# EAGLE design Maduino Zero Canbus RS485 v2.0 (EAGLE 6.1)
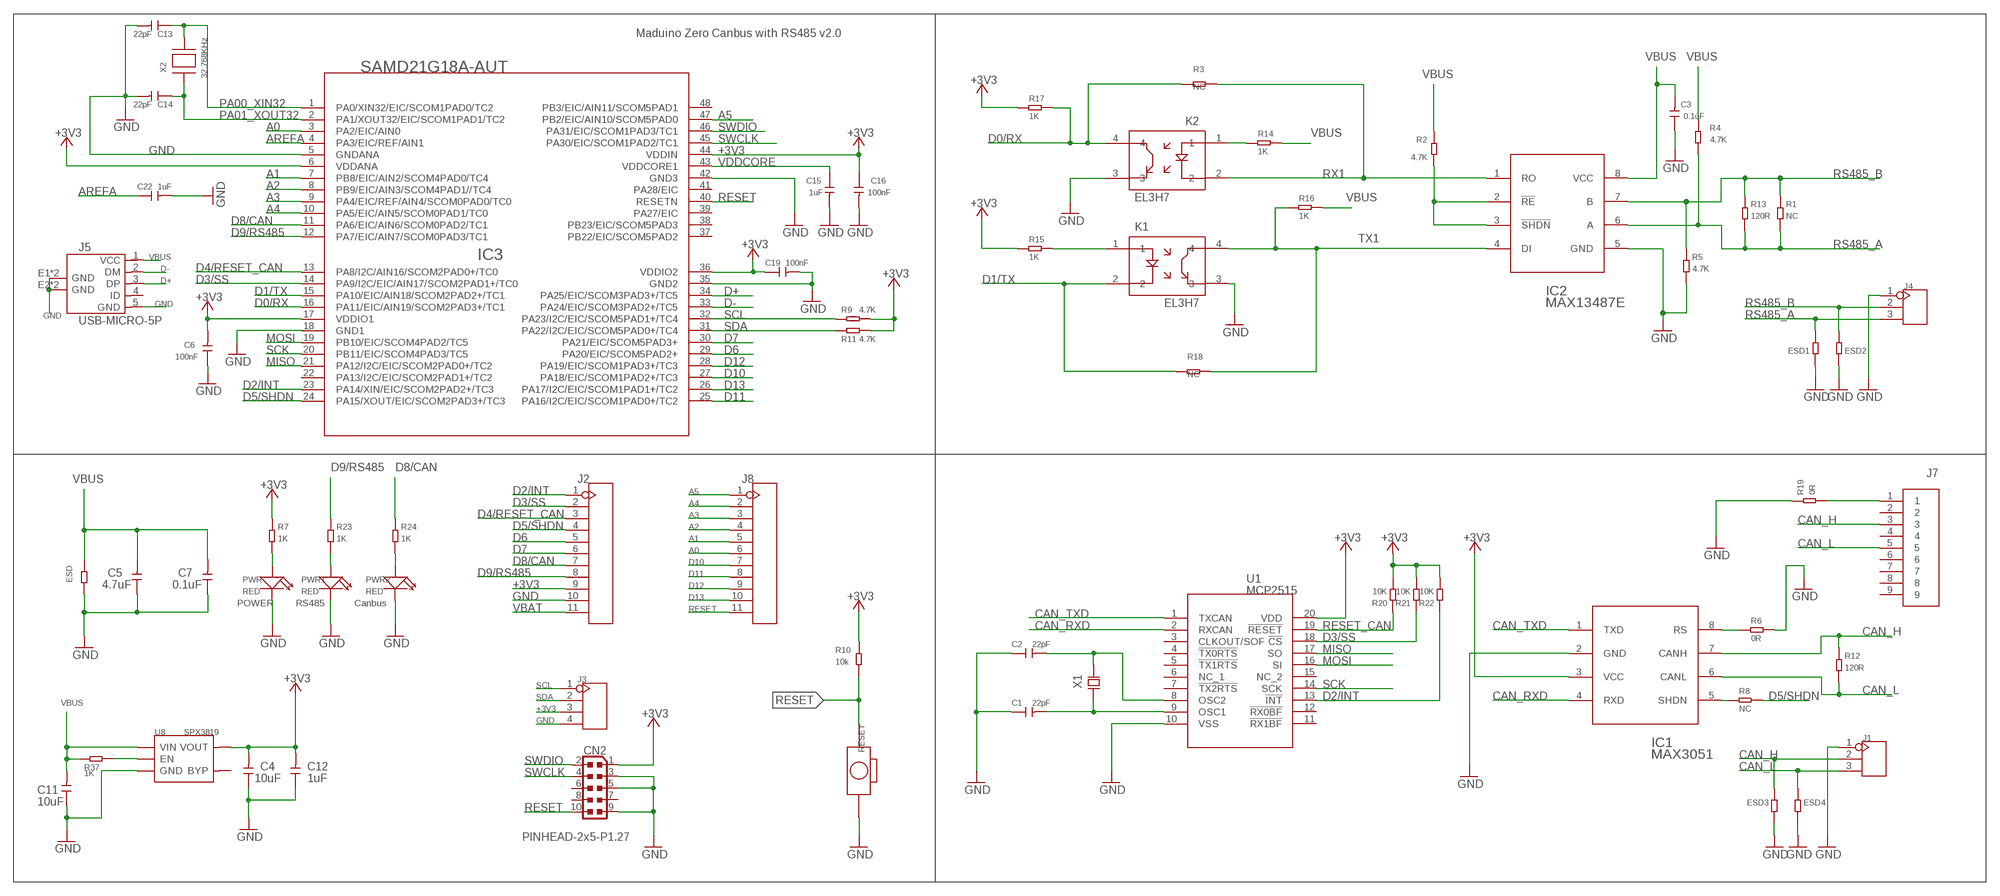
[diagram p0: schematic, sheet 1]

## Parts
C1  22pF  C-0603  [0603]
C2  22pF  C-0603  [0603]
C3  0.1uF  C-0603  [0603]
C4  10uF  C-0603  [0603]
C5  4.7uF  C-0603  [0603]
C6  100nF  C-0603  [0603]
C7  0.1uF  C-0603  [0603]
C11  10uF  C-0603  [0603]
C12  1uF  C-0603  [0603]
C13  22pF  C-0603  [0603]
C14  22pF  C-0603  [0603]
C15  1uF  C-0603  [0603]
C16  100nF  C-0603  [0603]
C19  100nF  C-0603  [0603]
C22  1uF  C-0603  [0603]
CN2  PINHEAD-2x5-P1.27  0171_PH127-205DF055G00AROUND-PADS  [PINHEAD_2X05_127]
ESD  R-0603  [R0603]
ESD1  R-0603  [R0603]
ESD2  R-0603  [R0603]
ESD3  NC  R-0603  [R0603]
ESD4  NC  R-0603  [R0603]
IC1  MAX3051  [DIP8_MX3051]
IC2  MAX13487E  [DIP8_MAX13487]
IC3  SAMD21G18A-AUT  ATSAMD21G18A-AUT  [TQFP48-7X7]
J1  HEADER-3P-2.54  [3P-2.54]
J2  HEADER-11P-2.54  [11P-2.54]
J3  HEADER-4P-60/35MILROUND  [4P-65/35ROUND]
J4  HEADER-3P-2.54  [3P-2.54]
J5  USB-MICRO-5P  [MICRO-USB-5P]
J7  DB9-90  [DIP9-DB9-P2.77]
J8  HEADER-11P-2.54  [11P-2.54]
K1  EL3H7  [SOP-4_P1.27]
K2  EL3H7  [SOP-4_P1.27]
PWR  RED  LED'0603'  [LED-0603]
PWR1  RED  LED'0603'  [LED-0603]
PWR2  RED  LED'0603'  [LED-0603]
R1  NC  R-0603  [R0603]
R2  4.7K  R-0603  [R0603]
R3  NC  R-0603  [R0603]
R4  4.7K  R-0603  [R0603]
R5  4.7K  R-0603  [R0603]
R6  0R  R-0603  [R0603]
R7  1K  R-0603  [R0603]
R8  NC  R-0603  [R0603]
R9  4.7K  R-0603  [R0603]
R10  10k  R-0603  [R0603]
R11  4.7K  R-0603  [R0603]
R12  120R  R-0603  [R0603]
R13  120R  R-0603  [R0603]
R14  1K  R-0603  [R0603]
R15  1K  R-0603  [R0603]
R16  1K  R-0603  [R0603]
R17  1K  R-0603  [R0603]
R18  NC  R-0603  [R0603]
R19  0R  R-0603  [R0603]
R20  10K  R-0603  [R0603]
R21  10K  R-0603  [R0603]
R22  10K  R-0603  [R0603]
R23  1K  R-0603  [R0603]
R24  1K  R-0603  [R0603]
R37  1K  R-0603  [R0603]
RESET  BOTTON-2P-90D  [2P-7.62X3.56-90D]
U1  MCP2515  [SSOP-20]
U8  SPX3819  [SOT23-5]
X1  XTAL-8MHZ  [SMD-5032_2P_8M]
X2  32.768KHz  XTAL-3.2X1.5  [XTAL3215]

## Nets
+3V3: C4.2 C6.2 C12.2 C16.1 C19.1 CN2.1 IC1.3(VCC) IC3.6(VDDANA) IC3.17(VDDIO1) IC3.36(VDDIO2) IC3.44(VDDIN) J2.9 J3.3 R7.1 R9.2 R10.2 R11.2 R15.2 R17.2 R20.1 R21.1 R22.1 U1.20(VDD) U8.5(VOUT)
A0: IC3.3(PA2/EIC/AIN0) J8.6
A1: IC3.7(PB8/EIC/AIN2/SCOM4PAD0/TC4) J8.5
A2: IC3.8(PB9/EIC/AIN3/SCOM4PAD1//TC4) J8.4
A3: IC3.9(PA4/EIC/REF/AIN4/SCOM0PAD0/TC0) J8.3
A4: IC3.10(PA5/EIC/AIN5/SCOM0PAD1/TC0) J8.2
A5: IC3.47(PB2/EIC/AIN10/SCOM5PAD0) J8.1
AREFA: C22.1 IC3.4(PA3/EIC/REF/AIN1)
CAN_H: ESD3.1 IC1.7(CANH) J1.2 J7.3 R12.1
CAN_L: ESD4.1 IC1.6(CANL) J1.3 J7.5 R12.2
CAN_RXD: IC1.4(RXD) U1.2(RXCAN)
CAN_TXD: IC1.1(TXD) U1.1(TXCAN)
D0/RX: IC3.16(PA11/EIC/AIN19/SCOM2PAD3+/TC1) K2.4 R3.2 R17.1
D1/TX: IC3.15(PA10/EIC/AIN18/SCOM2PAD2+/TC1) K1.2 R18.2
D2/INT: IC3.23(PA14/XIN/EIC/SCOM2PAD2+/TC3) J2.1 R22.2 U1.13(!INT)
D3/SS: IC3.14(PA9/I2C/EIC/AIN17/SCOM2PAD1+/TC0) J2.2 R21.2 U1.18(!CS)
D4/RESET_CAN: IC3.13(PA8/I2C/AIN16/SCOM2PAD0+/TC0) J2.3
D5/SHDN: IC3.24(PA15/XOUT/EIC/SCOM2PAD3+/TC3) J2.4 R8.1
D6: IC3.29(PA20/EIC/SCOM5PAD2+) J2.5
D7: IC3.30(PA21/EIC/SCOM5PAD3+) J2.6
D8/CAN: IC3.11(PA6/EIC/AIN6/SCOM0PAD2/TC1) J2.7 R24.1
D9/RS485: IC3.12(PA7/EIC/AIN7/SCOM0PAD3/TC1) J2.8 R23.1
D10: IC3.27(PA18/EIC/SCOM1PAD2+/TC3) J8.7
D11: IC3.25(PA16/I2C/EIC/SCOM1PAD0+/TC2) J8.8
D12: IC3.28(PA19/EIC/SCOM1PAD3+/TC3) J8.9
D13: IC3.26(PA17/I2C/EIC/SCOM1PAD1+/TC2) J8.10
D+: IC3.34(PA25/EIC/SCOM3PAD3+/TC5) J5.3(DP)
D-: IC3.33(PA24/EIC/SCOM3PAD2+/TC5) J5.2(DM)
GND: C1.1 C2.1 C3.1 C4.1 C5.1 C6.1 C7.1 C11.1 C12.1 C13.2 C14.2 C15.2 C16.2 C19.2 C22.2 CN2.3 CN2.5 CN2.9 ESD1.1 ESD2.1 ESD3.2 ESD4.2 ESD.2 IC1.2(GND) IC2.5(GND) IC3.5(GNDANA) IC3.18(GND1) IC3.35(GND2) IC3.42(GND3) J1.1 J2.10 J3.4 J4.1 J5.5(GND) J5.E1(GND) J5.E2(GND) J5.P1(GND) J5.P2(GND) K1.3 K2.3 PWR1.- PWR2.- PWR.- R5.1 R6.1 R19.2 RESET.P$2 U1.10(VSS) U8.2(GND)
MISO: IC3.21(PA12/I2C/EIC/SCOM2PAD0+/TC2) U1.17(SO)
MOSI: IC3.19(PB10/EIC/SCOM4PAD2/TC5) U1.16(SI)
N$1: K2.1 R14.2
N$3: PWR.+ R7.2
N$4: C2.2 U1.8(OSC2) X1.2
N$5: C1.2 U1.9(OSC1) X1.1
N$6: K1.1 R15.1
N$7: J7.1 R19.1
N$8: PWR1.+ R23.2
N$9: PWR2.+ R24.2
N$18: IC1.8(RS) R6.2
N$21: IC1.5(SHDN) R8.2
N$24: R37.2 U8.3(EN)
N$36: IC2.2(!RE) IC2.3(!SHDN) R2.1
PA00_XIN32: C13.1 IC3.1(PA0/XIN32/EIC/SCOM1PAD0/TC2) X2.P$2
PA01_XOUT32: C14.1 IC3.2(PA1/XOUT32/EIC/SCOM1PAD1/TC2) X2.P$1
RESET: CN2.10 IC3.40(RESETN) J8.11 R10.1 RESET.P$1
RESET_CAN: R20.2 U1.19(!RESET)
RS485_A: ESD1.2 IC2.6(A) J4.3 R1.1 R4.1 R13.1
RS485_B: ESD2.2 IC2.7(B) J4.2 R1.2 R5.2 R13.2
RX1: IC2.1(RO) K2.2 R3.1
SCK: IC3.20(PB11/EIC/SCOM4PAD3/TC5) U1.14(SCK)
SCL: IC3.32(PA23/I2C/EIC/SCOM5PAD1+/TC4) J3.1 R9.1
SDA: IC3.31(PA22/I2C/EIC/SCOM5PAD0+/TC4) J3.2 R11.1
SWCLK: CN2.4 IC3.45(PA30/EIC/SCOM1PAD2/TC1)
SWDIO: CN2.2 IC3.46(PA31/EIC/SCOM1PAD3/TC1)
TX1: IC2.4(DI) K1.4 R16.2 R18.1
VBAT: J2.11
VBUS: C3.2 C5.2 C7.2 C11.2 ESD.1 IC2.8(VCC) J5.1(VCC) R2.2 R4.2 R14.1 R16.1 R37.1 U8.1(VIN)
VDDCORE: C15.1 IC3.43(VDDCORE1)
Unconnected: CN2.6 CN2.7 CN2.8 IC3.22(PA13/I2C/EIC/SCOM2PAD1+/TC2) IC3.37(PB22/EIC/SCOM5PAD2) IC3.38(PB23/EIC/SCOM5PAD3) IC3.39(PA27/EIC) IC3.41(PA28/EIC) IC3.48(PB3/EIC/AIN11/SCOM5PAD1) J5.4(ID) J7.2 J7.4 J7.6 J7.7 J7.8 J7.9 U1.3(CLKOUT/SOF) U1.4(!TX0RTS) U1.5(!TX1RTS) U1.6(NC_1) U1.7(!TX2RTS) U1.11(!RX1BF) U1.12(!RX0BF) U1.15(NC_2) U8.4(BYP)

## Notes on the sheet
- Maduino Zero Canbus with RS485 v2.0
- POWER | RS485 | Canbus

## Library data of the parts
C1-C7 C11-C16 C19 C22 = Discrete:C*: Ceramic Capacitors
CN2 = Connettori:0171_PH127-205DF055G00A: 2x5 PASSO 1,27
ESD ESD1-ESD4 R1-R24 R37 = Discrete:R*
IC1 = 1mytest:MAX3051
IC2 = 1mytest:MAX13487E
IC3 = IC:ATSAMD21G18A-AUT: Atmel D21 32bit ARM Cortex-M0 microcontroller - 48 PIN TQFP 256KB flash memory + 32KB SRAM
J1 J4 = Connector:HEADER-3P
J2 J8 = Connector:HEADER-11P
J3 = Connector:HEADER-4P
J5 = Connector:USB-MICRO-5P
J7 = 1mytest:DB9-90
K1 K2 = 1mytest:EL3H7: Optocoupler
PWR PWR1 PWR2 = Discrete:LED*
RESET = Discrete:BOTTON-2P
U1 = 1mytest:MCP2515
U8 = IC:SPX3819
X1 = 1mytest:XTAL-8MHZ
X2 = adafruit2:XTAL: Low cost SMT crystals, no capacitors included http://www.ladyada.net/library/eagle

## Net classes
0 default: clearance 0.152 mm
2 gnd: width 0.305 mm, drill 0.559 mm, clearance 0.254 mm
3 usbvcc: width 0.508 mm, drill 0.61 mm, clearance 0.254 mm
4 USBpair: width 0.254 mm, drill 0.406 mm, clearance 0.406 mm

## Board
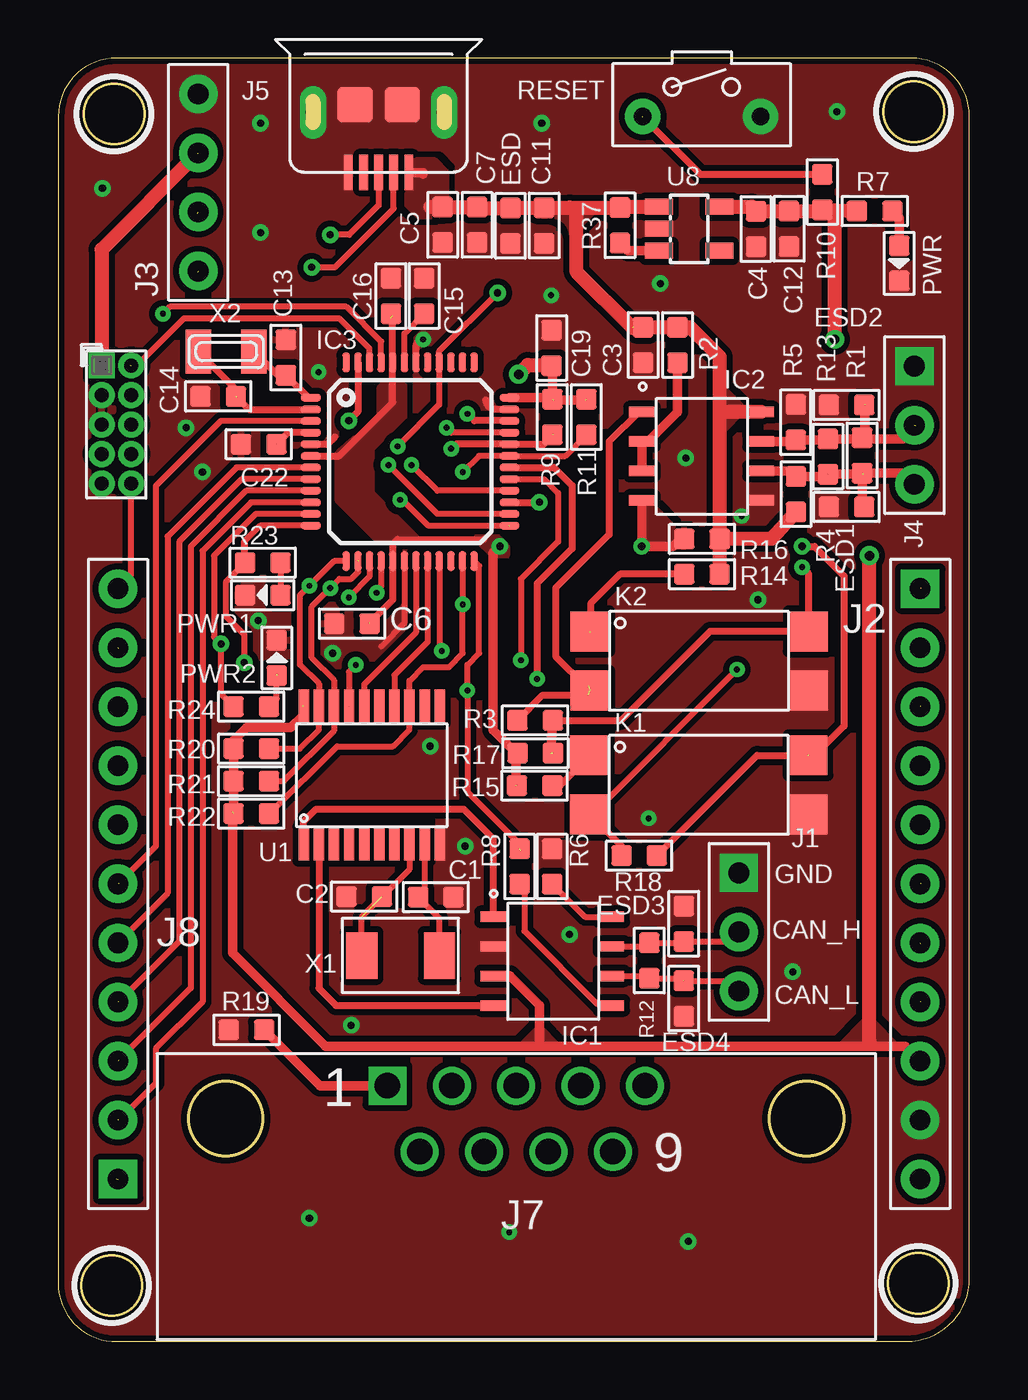
[diagram p1: board, top side]
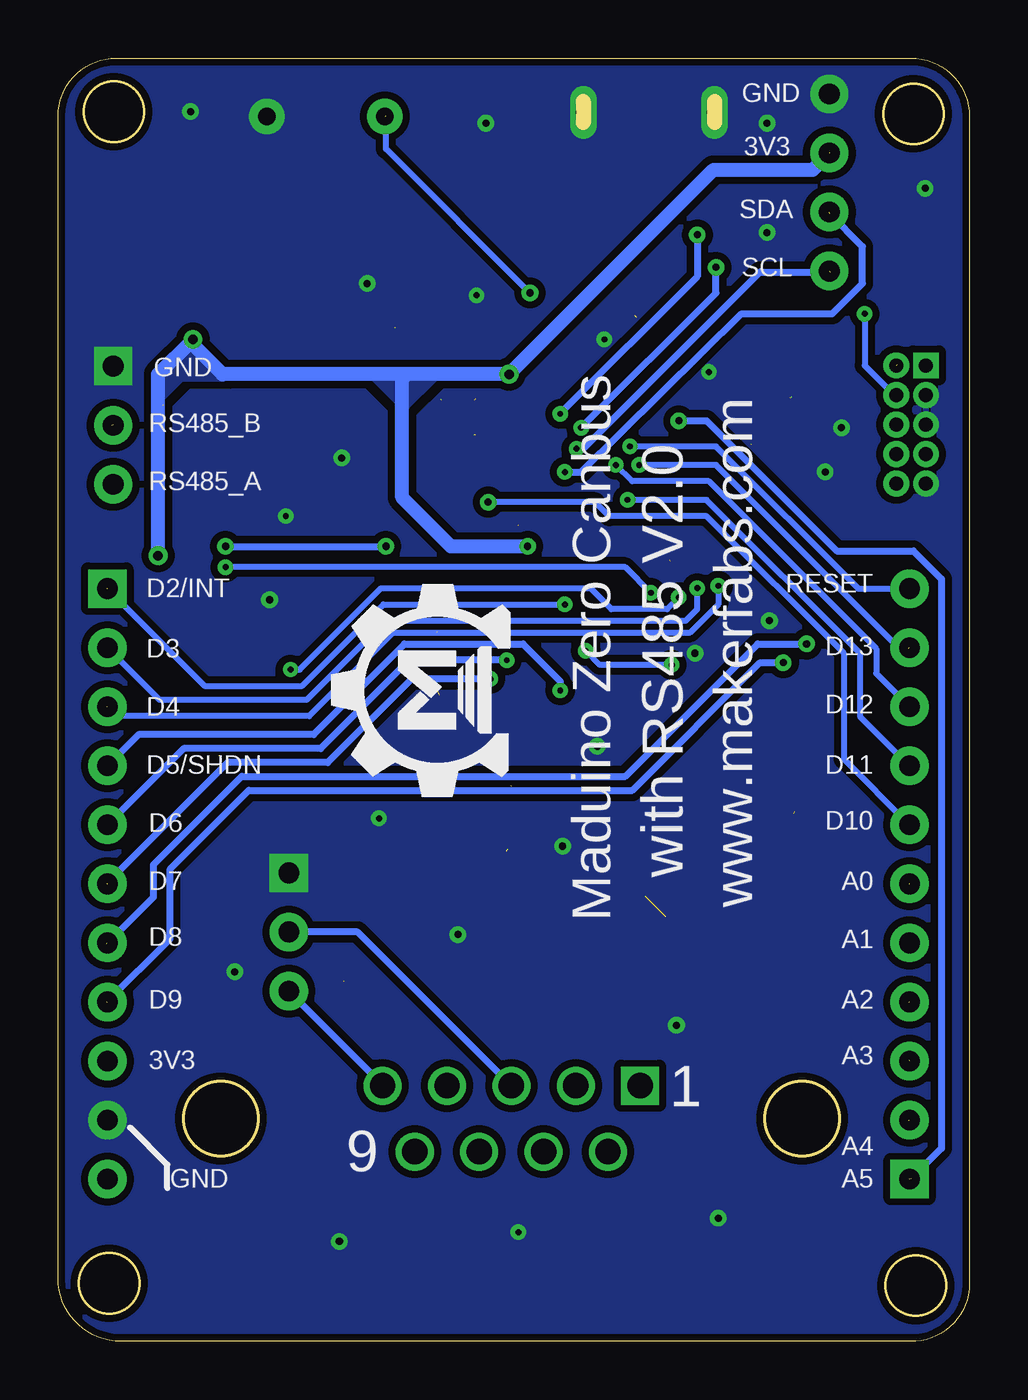
[diagram p2: board, bottom side, seen from below]

Size 39.21 x 55.2 mm. Coordinates in mm from the lower left corner, seen from the top.
Outline: 2.51,55.2 arc90 0.01,52.7 0.01,2.7 arc90 2.31,0 36.51,0 arc90 39.21,2.7 39.21,52.7 arc90 36.71,55.2 2.51,55.2
Outline: circle at 2.41,52.8 radius 1.3
Outline: circle at 2.31,2.4 radius 1.3
Outline: circle at 37.01,2.5 radius 1.3
Outline: circle at 36.81,52.9 radius 1.3
Copper layers (1*16): Top 0.035mm / dielectric 1.5mm / Bottom 0.035mm
Design rules: minimum track width 10mil, minimum drill 10mil, track to track 8mil, track to pad 8mil, pad to pad 8mil, via to via 8mil, smd to smd 8mil, copper to edge 10mil, drill to drill 8mil, minimum pad ring 10mil, minimum via ring 8mil, stop-mask expansion 4mil, vias tented up to drill 100mil, thermal gap 0mil

### Footprints (pad centres in the part's own frame; a part is rotated, then mirrored left to right if it is on the bottom)
0603 = smd 0.889 x 0.889: 1 -0.762,0; 2 0.762,0
PINHEAD_2X05_127 = drill 0.6 pad 1.016 square: 1 -0.635,2.54 | drill 0.6 pad 1.016: 2 0.635,2.54; 3 -0.635,1.27; 4 0.635,1.27; 5 -0.635,0; 6 0.635,0; 7 -0.635,-1.27; 8 0.635,-1.27; 9 -0.635,-2.54; 10 0.635,-2.54
R0603 = smd 0.889 x 0.889: 1 -0.762,0; 2 0.762,0
DIP8_MX3051 = smd 1.1 x 0.45: 1 1.27,3.81; 2 1.27,2.54; 3 1.27,1.27; 4 1.27,0; 5 6.35,0; 6 6.35,1.27; 7 6.35,2.54; 8 6.35,3.81
DIP8_MAX13487 = smd 1.1 x 0.45: 1 1.27,3.81; 2 1.27,2.54; 3 1.27,1.27; 4 1.27,0; 5 6.39,0; 6 6.39,1.27; 7 6.39,2.54; 8 6.39,3.81
TQFP48-7X7 = smd 0.85 x 0.32: 1 -4.275,2.75; 2 -4.275,2.25; 3 -4.275,1.75; 4 -4.275,1.25; 5 -4.275,0.75; 6 -4.275,0.25; 7 -4.275,-0.25; 8 -4.275,-0.75; 9 -4.275,-1.25; 10 -4.275,-1.75; 11 -4.275,-2.25; 12 -4.275,-2.75; 25 4.275,-2.75; 26 4.275,-2.25; 27 4.275,-1.75; 28 4.275,-1.25; 29 4.275,-0.75; 30 4.275,-0.25; 31 4.275,0.25; 32 4.275,0.75; 33 4.275,1.25; 34 4.275,1.75; 35 4.275,2.25; 36 4.275,2.75 | smd 0.32 x 0.85: 13 -2.75,-4.275; 14 -2.25,-4.275; 15 -1.75,-4.275; 16 -1.25,-4.275; 17 -0.75,-4.275; 18 -0.25,-4.275; 19 0.25,-4.275; 20 0.75,-4.275; 21 1.25,-4.275; 22 1.75,-4.275; 23 2.25,-4.275; 24 2.75,-4.275; 37 2.75,4.275; 38 2.25,4.275; 39 1.75,4.275; 40 1.25,4.275; 41 0.75,4.275; 42 0.25,4.275; 43 -0.25,4.275; 44 -0.75,4.275; 45 -1.25,4.275; 46 -1.75,4.275; 47 -2.25,4.275; 48 -2.75,4.275
3P-2.54 = drill 0.889 pad 1.651 square: 1 0,2.54 | drill 0.889 pad 1.651: 2 0,0; 3 0,-2.54
11P-2.54 = drill 0.889 pad 1.651 square: 1 0,12.7 | drill 0.889 pad 1.651: 2 0,10.16; 3 0,7.62; 4 0,5.08; 5 0,2.54; 6 0,0; 7 0,-2.54; 8 0,-5.08; 9 0,-7.62; 10 0,-10.16; 11 0,-12.7
4P-65/35ROUND = drill 0.889 pad 1.651: 1 0,3.81; 2 0,1.27; 3 0,-1.27; 4 0,-3.81
MICRO-USB-5P = smd 0.38 x 1.52: 1 -1.3,0; 2 -0.65,0; 3 0,0; 4 0.65,0; 5 1.3,0 | smd 1.524 x 1.524: E1 -1.016,-2.921; E2 1.016,-2.921 | drill 0.635 pad 1.143 long: P1 -2.819,-2.591; P2 2.819,-2.591
DIP9-DB9-P2.77 = drill 1.09 square: 1 -5.54,0 | drill 1.09: 2 -2.77,0; 3 0,0; 4 2.77,0; 5 5.54,0; 6 -4.155,-2.84; 7 -1.385,-2.84; 8 1.385,-2.84; 9 4.155,-2.84
SOP-4_P1.27 = smd 1.68 x 1.71: 1 0,2.54; 2 0,0; 3 9.39,0; 4 9.39,2.54
LED-0603 = smd 0.889 x 0.889: + -0.762,0; - 0.762,0
2P-7.62X3.56-90D = drill 0.762 pad 1.524: P$1 0,2.54; P$2 0,-2.54
SSOP-20 = smd 0.45 x 1.45: 1 0,0; 2 0.65,0; 3 1.3,0; 4 1.95,0; 5 2.6,0; 6 3.25,0; 7 3.9,0; 8 4.55,0; 9 5.2,0; 10 5.85,0; 11 5.85,5.9; 12 5.2,5.9; 13 4.55,5.9; 14 3.9,5.9; 15 3.25,5.9; 16 2.6,5.9; 17 1.95,5.9; 18 1.3,5.9; 19 0.65,5.9; 20 0,5.9
SOT23-5 = smd 0.69 x 1.2: 1 -0.95,-1.3; 2 0,-1.3; 3 0.95,-1.3; 4 0.95,1.3; 5 -0.95,1.3
SMD-5032_2P_8M = smd 1.35 x 2: 1 0,0; 2 3.35,0
XTAL3215 = smd 1.1 x 1.9: P$1 1.2,0; P$2 -1.2,0

### Placement (x,y rotation side)
C1  16.25,19.11 180 top
C2  13.17,19.13 0 top
C3  25.17,42.86 90 top
C4  30.03,47.85 90 top
C5  16.55,48.03 90 top
C6  12.64,30.87 0 top
C7  18.03,48.03 90 top
C11  20.91,48 90 top
C12  31.45,47.86 90 top
C13  9.8,42.32 90 top
C14  6.89,40.65 180 top
C15  15.75,44.97 90 top
C16  14.32,44.97 90 top
C19  21.23,42.73 90 top
C22  8.63,38.59 180 top
CN2  2.51,39.44 0 top
ESD  19.46,47.99 270 top
ESD1  33.92,35.89 0 top
ESD2  33.92,40.28 0 top
ESD3  26.92,17.96 90 top
ESD4  26.92,14.75 270 top
IC1  17.45,14.45 0 top
IC2  23.85,36.17 0 top
IC3  15.15,37.84 0 top
J1  29.29,17.61 0 top
J2  37.09,19.68 0 top
J3  6.03,49.85 180 top
J4  36.84,39.41 0 top
J5  13.79,50.28 180 top
J7  19.71,11 0 top
J8  2.58,19.68 180 top
K1  22.87,22.67 0 top
K2  22.88,28 0 top
PWR  36.19,46.37 270 top
PWR1  8.81,32.1 180 top
PWR2  9.41,29.4 90 top
R1  34.59,38.11 90 top
R2  26.65,42.86 90 top
R3  20.52,26.71 0 top
R4  31.75,36.44 270 top
R5  31.74,39.54 270 top
R6  21.25,20.43 270 top
R7  35.13,48.62 0 top
R8  19.86,20.43 270 top
R9  21.26,39.76 90 top
R10  32.88,49.44 270 top
R11  22.73,39.76 90 top
R12  25.44,16.38 270 top
R13  33.12,38.06 90 top
R14  27.7,33 180 top
R15  20.5,23.91 180 top
R16  27.7,34.52 180 top
R17  20.53,25.3 180 top
R18  25,20.9 180 top
R19  8.11,13.4 180 top
R20  8.31,25.5 0 top
R21  8.31,24.1 0 top
R22  8.31,22.7 0 top
R23  8.81,33.5 0 top
R24  8.31,27.3 0 top
R37  24.18,48.01 270 top
RESET  27.69,52.69 90 top
U1  10.57,21.41 0 top
U8  27.15,47.86 270 top
U$1  [MAKERFABS_0.3]  19.82,23.9 90 bottom
X1  16.41,16.6 180 top
X2  7.23,42.58 180 top

### Tracks (layer width: path | path; a pad name or v marks a point on that pad's centre or on a via)
+3V3  (via drill 0.3, 0.41)  (8 unrouted)
  Top 0.254: 36.45,12.7 35.11,12.7 34.91,12.9
  Top 0.305: C16.1 14.4,44.13 IC3.44 14.4,40.39 12.1,38.09 IC3.6 | 18.31,34.5 14.61,34.5 14.41,34.3 IC3.17 14.4,31.89 13.41,30.9 | R20.1 7.55,25.84 | 10.51,26.9 10.51,27.3
  Top 0.406: IC1.3 19.44,15.72 20.71,14.45 20.71,12.8 | 20.71,12.8 20.71,12.7 11.51,12.7 7.51,16.7 7.51,22.8 | 14.31,44.03 14.31,44 | IC3.36 21.22,40.59 21.31,40.5 22.71,40.5 | C19.1 21.26,41.94 R9.2 | 14.4,44.13 | R17.2 19.71,25.3 | 19.71,25.3 | 19.71,25.3 19.71,23.9 | R20.1 R21.1 R22.1 | J2.9 36.45,12.7 20.81,12.7 20.71,12.8 | v19.01,34.2 18.71,33.9 18.71,26.3 19.71,25.3 | 7.55,25.84 8.11,26.4 10.01,26.4 10.51,26.9
  Top 0.61: U8.5 29.83,48.81 C4.2 C12.2 32.84,48.62 R10.2 33.43,48.66 | 33.43,48.66 R7.1 | v33.41,43.1 33.41,48.64 33.43,48.66 | 34.91,12.9 v34.91,33.8 | v19.81,41.6 20.21,42 21.31,42 21.28,41.97 C19.1 | 6.01,51.1 1.87,46.96 CN2.1
  Bottom 0.61: 24.21,41.6 v19.81,41.6 11.01,50.4 6.75,50.4 J3.3 | 24.21,41.6 32.14,41.6 33.41,42.87 v33.41,43.1 34.91,41.6 v34.91,33.8 | v19.01,34.2 22.31,34.2 24.41,36.3 24.41,41.4 24.21,41.6
  pour Top (isolate 0.61): 20.71,13.5 20.01,12.8 20.01,12.7 21.51,12.7
  pour Bottom (isolate 0.305): 32.11,41.4 33.91,41.4 34.81,40.5 34.91,40.6 34.91,41.5 33.61,42.8 33.61,42.8 33.38,42.8 32.11,41.53
  pour Bottom (isolate 0.305): 23.01,41.4 24.21,40.2 24.41,40.2 25.71,41.5 23.11,41.5
  pour Top (isolate 0.305): 12.01,38.2 12.01,36.2 13.71,34.5 15.51,34.5 13.51,36.5 13.51,38.4 14.91,39.8 14.91,41.1 14.71,41.3 14.11,41.3 13.81,41 13.81,39.8 13.41,39.4
  pour Top: 34.71,13.8 33.61,12.7 33.61,12.7 35.91,12.7 36.11,12.7 36.11,12.7 35.01,13.8
  pour Top: 18.01,34.6 18.91,34.6 19.21,34.3 19.31,34.2 19.31,33.8 18.71,33.8 18.01,34.5
A0  (1 unrouted)
  Top 0.254: IC3.3 7,39.59 4.21,36.8 4.21,21.3 2.61,19.7
A1
  Top 0.254: IC3.7 7.68,37.59 4.71,34.62 4.71,19.27 J8.5
A2  (1 unrouted)
  Top 0.254: IC3.8 7.9,37.09 5.21,34.4 5.21,17.2 2.61,14.6
A3  (1 unrouted)
  Top 0.254: IC3.9 8.1,36.59 5.71,34.2 5.71,15.2 2.61,12.1
A4  (1 unrouted)
  Top 0.254: IC3.10 8.3,36.09 6.21,34 6.21,14.6 4.21,12.6 4.21,11.1 2.61,9.5
A5  (via drill 0.3)  (1 unrouted)
  Top 0.305: IC3.47 12.9,39.99 v12.51,39.6
  Bottom 0.305: v12.51,39.6 11.31,39.6 5.71,34 2.41,34 1.21,32.8 1.21,8.3 2.51,7
AREFA  (1 unrouted)
  Top 0.305: IC3.4 9.9,39.09 9.41,38.6
CAN_H
  Top 0.254: IC1.7 25.4,16.99 25.46,17.05 | 25.46,17.05 25.51,17.1 | R12.1 25.5,17.2 | R12.1 26.86,17.14 ESD3.1 28.88,17.2 J1.2 | R12.1 25.44,17.07 25.46,17.05
  Bottom 0.305: J7.3 26.32,17.61 J1.2
CAN_L  (1 unrouted)
  Top 0.254: IC1.6 25.34,15.72 R12.2 26.81,15.62 | ESD4.1 28.85,15.51 J1.3
  Top 0.406: 26.81,15.62 26.81,15.6 ESD4.1
  Bottom 0.305: J7.5 25.25,11.03 J1.3
CAN_RXD
  Top 0.305: U1.2 11.22,15.19 11.96,14.45 IC1.4
CAN_TXD
  Top 0.305: U1.1 10.57,22.36 11.11,22.9 17.45,22.9 18.72,21.63 IC1.1
D0/RX  (via drill 0.25)  (1 unrouted)
  Top 0.254: IC3.16 13.9,32.49 v13.71,32.2
  Top 0.305: R17.1 21.39,25.2 | R3.2 24.22,26.71 28.05,30.54 K2.4 32.27,33.04 v32.01,33.3
  Top 0.406: R3.2 21.21,25.62 21.21,25.3
  Bottom 0.254: v32.01,33.3 14.81,33.3 v13.71,32.2
D1/TX  (via drill 0.25)
  Top 0.254: K1.2 22.98,22.67 v29.21,28.9 | IC3.15 13.4,32.89 v12.51,32
  Top 0.305: K1.2 24.24,21.3 R18.2
  Bottom 0.254: v29.21,28.9 28.81,28.9 25.31,32.4 16.31,32.4 15.41,31.5 13.01,31.5 v12.51,32
D2/INT  (via drill 0.25)  (2 unrouted)
  Top 0.254: IC3.23 17.41,33.55 v17.41,31.7 17.41,29.6 16.81,29 15.71,29 15.12,28.41 U1.13 arc90 U1.13 15.11,26.3 14.41,25.6 12.01,25.6 9.11,22.7 R22.2
  Bottom 0.254: v17.41,31.7 25.21,31.7 28.71,28.2 32.91,28.2 37.11,32.4
D3/SS  (via drill 0.25)  (1 unrouted)
  Top 0.254: R21.2 9.71,24.1 11.87,26.26 U1.18 11.87,28.44 10.91,29.4 10.91,31.6 v11.71,32.4 12.11,32.8 12.61,32.8 12.91,33.1 12.91,33.6
  Bottom 0.254: v11.71,32.4 11.71,31.5 12.21,31 25.11,31 25.61,30.5 28.51,27.6 34.85,27.6 J2.2
D4/RESET_CAN  (via drill 0.25)  (1 unrouted)
  Top 0.254: IC3.13 11.87,33.56 v10.81,32.5
  Bottom 0.254: v10.81,32.5 10.81,31.7 12.01,30.5 24.81,30.5 28.41,26.9 36.71,26.9 37.11,27.3
D5/SHDN  (via drill 0.25)  (1 unrouted)
  Top 0.254: 19.91,21.1 19.91,21.34 17.61,23.64 v17.61,28 17.61,29.1 18.11,29.6 18.11,33.35 IC3.24
  Bottom 0.305: v17.61,28 17.61,28.4 19.21,30 24.31,30 28.21,26.1 35.75,26.1 J2.4
D6  (via drill 0.25)
  Top 0.254: IC3.29 20.92,37.09 21.51,36.5 21.51,34.4 19.91,32.8 v19.91,29.3
  Bottom 0.305: v19.91,29.3 24.11,29.3 27.91,25.5 33.81,25.5 J2.5
D7  (via drill 0.25)  (1 unrouted)
  Top 0.305: IC3.30 21.34,37.59 22.11,36.82 22.11,34.1 20.61,32.6 v20.61,28.5
  Bottom 0.305: v20.61,28.5 24.01,28.5 27.61,24.9 31.91,24.9 37.11,19.7
D8/CAN  (via drill 0.3)  (2 unrouted)
  Top 0.254: IC3.11 8.5,35.59 6.71,33.8 6.71,30.3 v7.01,30 7.01,27.84 R24.1
  Bottom 0.305: v7.01,30 9.11,30 14.81,24.3 31.31,24.3 35.11,20.5 35.11,19.1 37.11,17.1
D9/RS485  (via drill 0.3)  (1 unrouted)
  Top 0.254: IC3.12 8.7,35.09 8.01,34.4 | R23.1 7.21,32.66 7.21,31.2 8.01,30.4 v8.01,29.2
  Top 0.305: 8.01,34.4 8.01,33.54 R23.1
  Bottom 0.305: v8.01,29.2 9.01,29.2 14.51,23.7 31.01,23.7 34.41,20.3 34.41,17.3 37.11,14.6
D10  (via drill 0.3)
  Top 0.305: IC3.27 v20.7,36.09 v20.71,36.1
  Bottom 0.254: v20.71,36.1 16.11,36.1 15.51,35.5 11.31,35.5 5.41,29.6 5.41,25.05 J8.7
D11  (via drill 0.25)  (1 unrouted)
  Top 0.254: 19.41,35.1 15.91,35.1 14.81,36.2 v14.71,36.2
  Bottom 0.254: v14.71,36.2 11.31,36.2 4.71,29.6 4.71,26.89 J8.8
D12  (via drill 0.25)
  Top 0.254: IC3.28 16.32,36.59 v15.21,37.7
  Bottom 0.254: v15.21,37.7 14.51,37 11.21,37 4.01,29.8 4.01,28.73 J8.9
D13  (via drill 0.25)  (1 unrouted)
  Top 0.254: IC3.26 16.32,35.59 v14.21,37.7
  Bottom 0.254: v14.21,37.7 10.91,37.7 3.01,29.8 2.61,29.8
D+  (via drill 0.25, 0.3)
  Top 0.254: J5.3 13.79,48.87 12.52,47.6 v11.71,47.6
  Top 0.305: IC3.34 19.41,39.6 17.91,39.6 v17.61,39.9
  Bottom 0.305: v17.61,39.9 11.71,45.8 v11.71,47.6
D-  (via drill 0.25, 0.3)
  Top 0.254: IC3.33 16.92,39.09 v16.71,39.3 | v10.91,46.2 11.91,46.2 14.44,48.73 J5.2
  Bottom 0.305: v16.71,39.3 10.91,45.1 v10.91,46.2
GND  (via drill 0.25, 0.3)
  Top 0.254: IC3.18 14.9,30.89 13.91,29.9
  Top 0.305: IC3.35 18.82,40.09 arc-90 18.41,40.5 | IC3.42 15.4,42.79 arc-90 v15.71,43.1 | IC3.5 11.6,38.59 11.91,38.9
  other vias: 11.21,41.7 6.21,37.4 5.51,39.3 16.01,25.6 17.51,21.3 12.61,13.6 22.01,17.5 27.01,38 31.61,15.9 30.11,31.9 29.41,35.5 25.41,22.5 21.21,45 19.41,4.7 10.81,5.3 27.11,4.3 8.71,52.4 20.81,52.4 11.81,29.6 8.61,31 8.71,47.7 33.51,52.9 1.91,49.6 25.91,45.5
  pour Top (isolate 0.254, rank 6): -0.49,57.1 39.51,57.1 arc-90 42.01,54.6 42.01,50.4 42.01,0.7 arc-90 39.51,-1.8 24.81,-1.8 0.11,-1.8 arc-90 -2.39,0.7 -2.39,45.5 -2.39,55.2 arc-90
  pour Bottom (isolate 0.305, rank 6): 4.81,56.4 38.21,56.4 arc-90 40.71,53.9 40.71,39.4 40.71,1.4 arc-90 38.21,-1.1 23.91,-1.1 1.21,-1.1 arc-90 -1.29,1.4 -1.29,43.6 -1.29,53.9 arc-90 1.21,56.4
MISO  (via drill 0.25)  (1 unrouted)
  Top 0.254: IC3.21 16.41,33.55 16.41,29.8 v16.51,29.7 | v12.81,29.1 12.51,28.8 U1.17 12.61,27.3
  Bottom 0.254: v12.81,29.1 15.91,29.1 v16.51,29.7
MOSI
  Top 0.254: IC3.19 15.4,30.49 13.17,28.26 U1.16
N$1  (1 unrouted)
  Top 0.305: R14.2 24.18,33 22.91,31.73 22.91,30.5
N$3
  Top 0.406: R7.2 36.19,48.32 PWR.+
N$4  (1 unrouted)
  Top 0.254: U1.8 15.12,20.31 13.06,18.25 X1.2
N$5
  Top 0.254: U1.9 15.77,19.39 C1.2 16.41,18.19 X1.1
N$6
  Top 0.305: R15.1 21.6,23.91 22.87,25.18 K1.1
N$7
  Top 0.406: R19.1 11.27,11 J7.1
N$8
  Top 0.254: R23.2 | R23.2 PWR1.+
N$9  (1 unrouted)
  Top 0.254: R24.2 9.41,27.64 9.41,28.7
N$18
  Top 0.254: R6.2 22.66,18.26 IC1.8
  Top 0.305: IC1.8 23.38,18.26
N$21
  Top 0.254: 23.75,14.5 23.21,14.5 20.06,17.65 20.06,19.47 R8.2
  Top 0.305: 23.75,14.5 IC1.5
N$24
  Top 0.305: R37.2 24.52,46.91
  Top 0.406: 24.52,46.91 U8.3
N$36
  Top 0.406: IC2.3 IC2.2 25.38,38.71 26.65,39.98 R2.1
PA00_XIN32
  Top 0.305: X2.P$2 9.45,41.56 C13.1 10.77,40.59 IC3.1
PA01_XOUT32  (1 unrouted)
  Top 0.305: C14.1 8.21,40.09 IC3.2 | X2.P$1 7.71,40.9 7.71,40.6
RESET  (via drill 0.25, 0.3)  (1 unrouted)
  Top 0.254: v18.91,45.1 16.4,42.59 IC3.40 16.4,40.29 v14.61,38.5 | J8.11 3.14,32.94 CN2.10
  Top 0.305: R10.1 27.64,50.2 RESET.P$1
  Bottom 0.254: v18.91,45.1 25.11,51.3 25.11,52.7 | v14.61,38.5 10.91,38.5 4.79,32.38 J8.11
RESET_CAN
  Top 0.254: 10.81,32.5 10.41,32.1 10.41,29.1 11.22,28.29 U1.19 11.22,26.31 10.41,25.5 R20.2
  Top 0.305: U1.19
RS485_A  (2 unrouted)
  Top 0.305: ESD1.2 34.61,35.96 | 33.01,37.2 R13.1
  Top 0.406: IC2.6 31.41,37.44 R4.1 33.01,37.2 | R13.1 34.64,37.3 R1.1 36.36,37.35 36.46,37.25 J4.3 | 34.61,35.96 34.61,37.3
RS485_B  (2 unrouted)
  Top 0.305: R1.2 34.71,38.99
  Top 0.406: IC2.7 31.67,38.71 R5.2 33.17,38.78 R13.2 34.64,38.82 | 34.64,38.82 R1.2 | 34.71,38.99 34.71,40.3 | 34.64,38.82 36.33,38.82 36.91,39.4
RX1  (2 unrouted)
  Top 0.305: IC2.1 24.98,39.98 23.71,38.71 23.71,34.7 21.41,32.4 21.41,29.47 22.68,28.2 22.81,28.2 | R3.1 20.85,27.8 22.81,27.8
SCK
  Top 0.254: IC3.20 15.9,30.09 14.47,28.66 U1.14
SCL  (via drill 0.25)  (2 unrouted)
  Top 0.305: v16.91,38.4 17.1,38.59 IC3.32 20.9,38.59 21.31,39
  Bottom 0.305: v16.91,38.4 16.61,38.4 9.01,46 6.01,46
SDA  (via drill 0.25)  (1 unrouted)
  Top 0.254: v17.41,37.4 18.1,38.09 IC3.31 21.82,38.09 R11.1
  Bottom 0.305: v17.41,37.4 16.71,37.4 9.81,44.2 5.91,44.2 4.61,45.5 4.61,47.1 6.01,48.5
SWCLK  (via drill 0.25)
  Top 0.254: IC3.45 13.9,43.01 12.41,44.5 4.81,44.5 v4.51,44.2
  Bottom 0.254: v4.51,44.2 4.51,41.98 3.24,40.71 CN2.4
SWDIO  (1 unrouted)
  Top 0.254: IC3.46 13.4,42.71 12.11,44 5.41,44 3.41,42 3.11,42
TX1  (via drill 0.3)  (1 unrouted)
  Top 0.305: 26.77,34.52 R16.2 | v25.11,34.2 v25.12,34.21 | v32.01,34.2 32.54,34.2 33.81,32.93 33.81,26.47 32.54,25.2 32.31,25.2 | R18.1 30.07,25.21 K1.4
  Top 0.406: v25.12,34.21 IC2.4 | 26.77,34.52 26.45,34.2 v25.11,34.2
  Bottom 0.305: v32.01,34.2 v25.11,34.2
  pour Top (isolate 0.254): 25.11,35.4 25.11,34.2 27.01,34.2 27.01,34.9 26.61,34.9 25.41,36.1 25.11,36.1
VBUS  (1 unrouted)
  Top 0.305: 22.31,48.5 22.01,48.77
  Top 0.406: J5.1 15.71,50.28 15.71,50.2
  Top 0.61: U8.1 24.32,48.81 R37.1 22.01,48.77 20.92,48.77 C11.2 19.47,48.76 ESD.1 18.07,48.75 C7.2 C5.2 16.02,48.79 16.01,48.8 | 24.74,43.62 C3.2 R2.2 27.19,43.62 28.46,42.35 28.46,40.1 | 28.46,40.1 R16.1 | R16.1 | R16.1 R14.1 | R4.2 30.69,34.52 R16.1 | IC2.8 28.58,39.98 arc-90 28.46,40.1 | 22.31,48.5 22.31,46 24.71,43.6
  pour Top (isolate 0.61): 20.61,48.7 21.91,47.4 21.91,47.5 23.11,48.7
  pour Top: 28.51,41 28.61,41 29.51,40.1 28.51,39.1
  pour Top (isolate 0.305): 15.01,49.8 15.01,48.9 15.51,48.4 16.31,48.4 16.71,48.8 16.71,50.3 16.21,50.8 15.91,50.8 15.41,50.8 15.01,50.4
VDDCORE
  Top 0.254: IC3.43 14.9,43.36 C15.1

### Text on the board
tPlace: CAN_H | CAN_L | 1 | 9
bPlace: GND | 3V3 | SDA | SCL | Maduino Zero Canbus | GND | www.makerfabs.com | RS485_B | with RS485 V2.0 | RS485_A | RESET | D2/INT | D13 | D3 | D12 | D4 | D11 | D5/SHDN | D10 | D6 | A0 | D7 | A1 | D8 | A2 | D9 | A3 | 3V3 | 1 | A4 | 9 | A5 | GND
tNames: GND